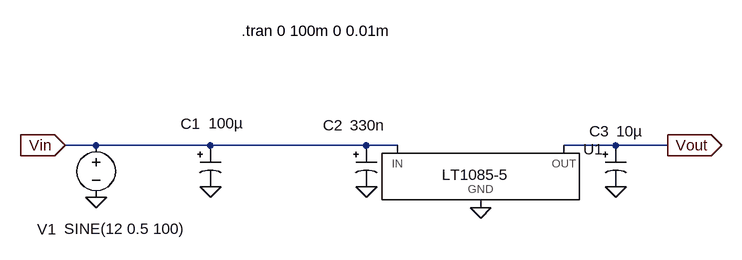
[diagram p0: schematic schema_ltspice.asc]
schema_ltspice.asc, the LTspice schematic file:
Version 4
SHEET 1 880 680
WIRE -352 144 -400 144
WIRE -176 144 -352 144
WIRE 64 144 -176 144
WIRE 112 144 64 144
WIRE 448 144 368 144
WIRE 528 144 448 144
WIRE 448 208 448 192
FLAG -176 208 0
FLAG -352 224 0
FLAG 528 144 Vout
IOPIN 528 144 Out
FLAG -400 144 Vin
IOPIN -400 144 In
FLAG 240 240 0
FLAG 64 208 0
FLAG 448 208 0
SYMBOL PowerProducts\\LT1085-5 240 144 R0
WINDOW 3 -60 45 Left 2
SYMATTR InstName U1
SYMBOL polcap -192 144 R0
WINDOW 3 13 -34 Left 2
WINDOW 0 -30 -33 Left 2
SYMATTR Value 100µ
SYMATTR InstName C1
SYMATTR Description Capacitor
SYMATTR Type cap
SYMATTR SpiceLine V=6.3 Irms=0 Rser=0.9 Lser=0 mfg="AVX" pn="TAJD107M006" type="Tantalum"
SYMBOL polcap 48 144 R0
WINDOW 3 -9 -31 Left 2
WINDOW 0 -51 -31 Left 2
SYMATTR Value 330n
SYMATTR InstName C2
SYMATTR Description Capacitor
SYMATTR Type cap
SYMATTR SpiceLine V=6.3 Irms=0 Rser=0.9 Lser=0
SYMBOL polcap 432 144 R0
WINDOW 3 17 -22 Left 2
WINDOW 0 -25 -22 Left 2
SYMATTR Value 10µ
SYMATTR InstName C3
SYMATTR Description Capacitor
SYMATTR Type cap
SYMATTR SpiceLine V=6.3 Irms=0 Rser=4 Lser=0 mfg="AVX" pn="TAJA106M006" type="Tantalum"
SYMBOL voltage -352 128 R0
WINDOW 3 -49 144 Left 2
WINDOW 123 0 0 Left 0
WINDOW 39 0 0 Left 0
WINDOW 0 -91 145 Left 2
SYMATTR Value SINE(12 0.5 100)
SYMATTR InstName V1
TEXT -128 -32 Left 2 !.tran 0 100m 0 0.01m

The netlist it stands for:
* schema_ltspice.asc
XU1 0 Vout Vin LT1085-5  ; pins GND OUT IN
C1 Vin 0 100µ V=6.3 Irms=0 Rser=0.9 Lser=0 mfg="AVX" pn="TAJD107M006" type="Tantalum"
C2 Vin 0 330n V=6.3 Irms=0 Rser=0.9 Lser=0
C3 Vout 0 10µ V=6.3 Irms=0 Rser=4 Lser=0 mfg="AVX" pn="TAJA106M006" type="Tantalum"
V1 Vin 0 SINE(12 0.5 100)
.tran 0 100m 0 0.01m
.backanno
.end